# Altium schematic sheet PowerSender.SchDoc
size A4
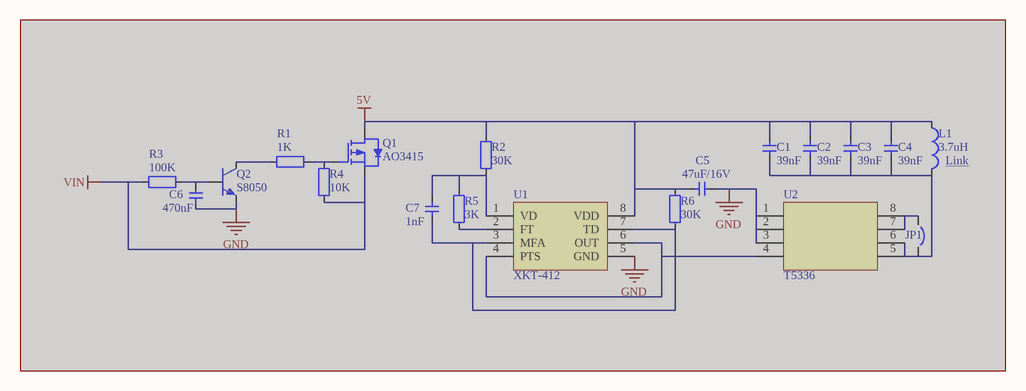
[diagram p0: PowerSender.SchDoc]

## Parts
C1  39nF  [CAP_1206]  (masked out: inside a compile mask, not in the netlist)
C2  39nF  [CAP_1206]  (masked out: inside a compile mask, not in the netlist)
C3  39nF  [CAP_1206]  (masked out: inside a compile mask, not in the netlist)
C4  39nF  [CAP_1206]  (masked out: inside a compile mask, not in the netlist)
C5  47uF/16V  [CAP_1206]  (masked out: inside a compile mask, not in the netlist)
C6  470nF  [CAP_0805]  (masked out: inside a compile mask, not in the netlist)
C7  1nF  [CAP_0805]  (masked out: inside a compile mask, not in the netlist)
JP1  (no value)  [JP_SMD]  (masked out: inside a compile mask, not in the netlist)
L1  3.7uH  [IND_1210]  (masked out: inside a compile mask, not in the netlist)
Q1  AO3415  [SOT323]  (masked out: inside a compile mask, not in the netlist)
Q2  S8050  [SOT23-3]  (masked out: inside a compile mask, not in the netlist)
R1  value 1K  [RES_0603]  (hidden comment: Res_0603)  (masked out: inside a compile mask, not in the netlist)
R2  value 30K  [RES_0603]  (hidden comment: Res_0603)  (masked out: inside a compile mask, not in the netlist)
R3  value 100K  [RES_0603]  (hidden comment: Res_0603)  (masked out: inside a compile mask, not in the netlist)
R4  value 10K  [RES_0603]  (hidden comment: Res_0603)  (masked out: inside a compile mask, not in the netlist)
R5  value 3K  [RES_0603]  (hidden comment: Res_0603)  (masked out: inside a compile mask, not in the netlist)
R6  value 30K  [RES_0603]  (hidden comment: Res_0603)  (masked out: inside a compile mask, not in the netlist)
U1  XKT-412  [SOIC_8]  (masked out: inside a compile mask, not in the netlist)
U2  T5336  [SOIC_8]  (masked out: inside a compile mask, not in the netlist)

## Notes on the sheet
- (near L1) Link <https://item.taobao.com/item.htm?spm=a1z0d.6639537.1997196601.67.swHxrp&id=41516185666>

## Library data of the parts
C1-C5 = Cap_1206: Capacitor; Value: ?F
C6 C7 = Cap_0805: Capacitor; Value: ?F
JP1 = Jumper
L1 = Ind_1210: Inductor; Value: ?H
Q1 = PMOS
Q2 = BJT_NPN: Transistor
R1-R6 = Res_0603: Resistor
U1 = XKT-412: Wireless charging sender
U2 = T5336: Wireless charging IC